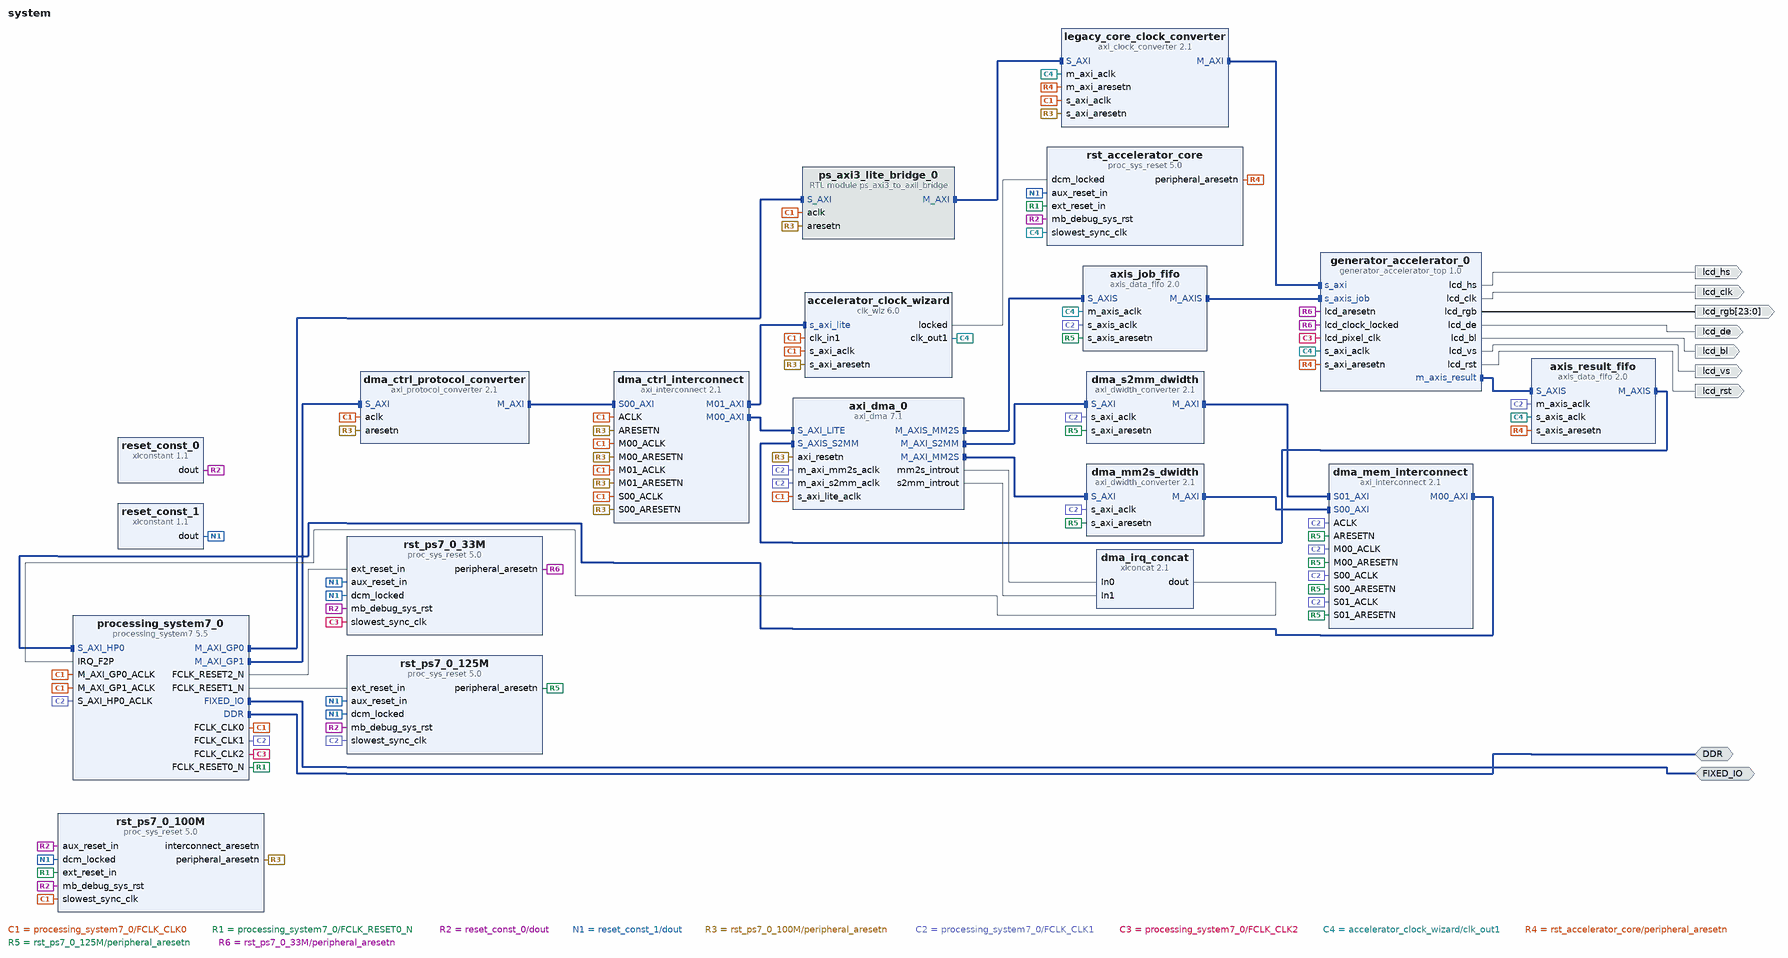
[diagram p0: block diagram of the top level]
# Vivado block design system, xc7z015clg485-2, Vivado 2019.2
create_bd_design system

create_bd_intf_port -mode Master -vlnv xilinx.com:interface:ddrx_rtl:1.0 DDR
create_bd_intf_port -mode Master -vlnv xilinx.com:display_processing_system7:fixedio_rtl:1.0 FIXED_IO
create_bd_port -dir O -from 23 -to 0 lcd_rgb
create_bd_port -dir O lcd_hs
create_bd_port -dir O lcd_vs
create_bd_port -dir O lcd_de
create_bd_port -dir O -type clk lcd_clk
create_bd_port -dir O -type rst lcd_rst
create_bd_port -dir O lcd_bl

create_bd_cell -type ip -vlnv xilinx.com:ip:processing_system7:5.5 processing_system7_0
set_property -dict [list \
  CONFIG.PCW_ENET0_ENET0_IO {MIO 16 .. 27} \
  CONFIG.PCW_ENET0_GRP_MDIO_ENABLE 1 \
  CONFIG.PCW_ENET0_GRP_MDIO_IO {MIO 52 .. 53} \
  CONFIG.PCW_ENET0_PERIPHERAL_ENABLE 1 \
  CONFIG.PCW_EN_CLK1_PORT 1 \
  CONFIG.PCW_EN_CLK2_PORT 1 \
  CONFIG.PCW_EN_RST1_PORT 1 \
  CONFIG.PCW_EN_RST2_PORT 1 \
  CONFIG.PCW_FCLK_CLK1_BUF TRUE \
  CONFIG.PCW_FCLK_CLK2_BUF TRUE \
  CONFIG.PCW_FPGA0_PERIPHERAL_FREQMHZ 100.000000 \
  CONFIG.PCW_FPGA1_PERIPHERAL_FREQMHZ 125.000000 \
  CONFIG.PCW_FPGA2_PERIPHERAL_FREQMHZ 33.000000 \
  CONFIG.PCW_FPGA_FCLK1_ENABLE 1 \
  CONFIG.PCW_FPGA_FCLK2_ENABLE 1 \
  CONFIG.PCW_GPIO_MIO_GPIO_ENABLE 0 \
  CONFIG.PCW_IRQ_F2P_INTR 1 \
  CONFIG.PCW_PRESET_BANK1_VOLTAGE {LVCMOS 1.8V} \
  CONFIG.PCW_UART0_PERIPHERAL_ENABLE 1 \
  CONFIG.PCW_UART0_UART0_IO {MIO 14 .. 15} \
  CONFIG.PCW_UART_PERIPHERAL_FREQMHZ 100 \
  CONFIG.PCW_UIPARAM_DDR_PARTNO {MT41K256M16 RE-125} \
  CONFIG.PCW_USE_FABRIC_INTERRUPT 1 \
  CONFIG.PCW_USE_M_AXI_GP1 1 \
  CONFIG.PCW_USE_S_AXI_HP0 1 \
] [get_bd_cells processing_system7_0]
# 92 more settings of processing_system7_0 are not shown: defaults, MIO pin electricals, DDR timing, and values the tool derives
create_bd_cell -type ip -vlnv xilinx.com:ip:proc_sys_reset:5.0 rst_ps7_0_100M
set_property -dict {CONFIG.C_AUX_RESET_HIGH 1} [get_bd_cells rst_ps7_0_100M]
create_bd_cell -type ip -vlnv xilinx.com:ip:xlconstant:1.1 reset_const_0
set_property -dict {CONFIG.CONST_VAL 0 CONFIG.CONST_WIDTH 1} [get_bd_cells reset_const_0]
create_bd_cell -type ip -vlnv xilinx.com:ip:xlconstant:1.1 reset_const_1
set_property -dict {CONFIG.CONST_VAL 1 CONFIG.CONST_WIDTH 1} [get_bd_cells reset_const_1]
create_bd_cell -type module -reference ps_axi3_to_axil_bridge ps_axi3_lite_bridge_0
create_bd_cell -type ip -vlnv xilinx.com:ip:axi_protocol_converter:2.1 dma_ctrl_protocol_converter
set_property -dict [list \
  CONFIG.ADDR_WIDTH 32 \
  CONFIG.DATA_WIDTH 32 \
  CONFIG.MI_PROTOCOL AXI4LITE \
  CONFIG.SI_PROTOCOL AXI3 \
] [get_bd_cells dma_ctrl_protocol_converter]
create_bd_cell -type ip -vlnv xilinx.com:ip:axi_interconnect:2.1 dma_ctrl_interconnect
set_property -dict {CONFIG.NUM_MI 2 CONFIG.NUM_SI 1} [get_bd_cells dma_ctrl_interconnect]
create_bd_cell -type ip -vlnv xilinx.com:ip:clk_wiz:6.0 accelerator_clock_wizard
set_property -dict [list \
  CONFIG.CLKOUT1_REQUESTED_OUT_FREQ 100.000 \
  CONFIG.INTERFACE_SELECTION Enable_AXI \
  CONFIG.PRIM_IN_FREQ 100.000 \
  CONFIG.USE_DYN_RECONFIG true \
] [get_bd_cells accelerator_clock_wizard]
create_bd_cell -type ip -vlnv xilinx.com:ip:axi_clock_converter:2.1 legacy_core_clock_converter
set_property -dict [list \
  CONFIG.ACLK_ASYNC 1 \
  CONFIG.ADDR_WIDTH 32 \
  CONFIG.DATA_WIDTH 32 \
  CONFIG.PROTOCOL AXI4LITE \
] [get_bd_cells legacy_core_clock_converter]
create_bd_cell -type ip -vlnv xilinx.com:ip:axi_dma:7.1 axi_dma_0
set_property -dict [list \
  CONFIG.c_include_mm2s 1 \
  CONFIG.c_include_mm2s_dre 0 \
  CONFIG.c_include_s2mm 1 \
  CONFIG.c_include_s2mm_dre 0 \
  CONFIG.c_include_sg 0 \
  CONFIG.c_m_axi_mm2s_data_width 128 \
  CONFIG.c_m_axi_s2mm_data_width 128 \
  CONFIG.c_m_axis_mm2s_tdata_width 128 \
  CONFIG.c_mm2s_burst_size 16 \
  CONFIG.c_s2mm_burst_size 16 \
  CONFIG.c_s_axis_s2mm_tdata_width 128 \
  CONFIG.c_sg_length_width 23 \
] [get_bd_cells axi_dma_0]
create_bd_cell -type ip -vlnv xilinx.com:ip:axi_dwidth_converter:2.1 dma_mm2s_dwidth
set_property -dict [list \
  CONFIG.ADDR_WIDTH 32 \
  CONFIG.MI_DATA_WIDTH 64 \
  CONFIG.PROTOCOL AXI4 \
  CONFIG.SI_DATA_WIDTH 128 \
] [get_bd_cells dma_mm2s_dwidth]
create_bd_cell -type ip -vlnv xilinx.com:ip:axi_dwidth_converter:2.1 dma_s2mm_dwidth
set_property -dict [list \
  CONFIG.ADDR_WIDTH 32 \
  CONFIG.MI_DATA_WIDTH 64 \
  CONFIG.PROTOCOL AXI4 \
  CONFIG.SI_DATA_WIDTH 128 \
] [get_bd_cells dma_s2mm_dwidth]
create_bd_cell -type ip -vlnv xilinx.com:ip:axis_data_fifo:2.0 axis_job_fifo
set_property -dict [list \
  CONFIG.FIFO_DEPTH 512 \
  CONFIG.HAS_TKEEP 1 \
  CONFIG.HAS_TLAST 1 \
  CONFIG.IS_ACLK_ASYNC 1 \
  CONFIG.TDATA_NUM_BYTES 16 \
] [get_bd_cells axis_job_fifo]
create_bd_cell -type ip -vlnv xilinx.com:ip:axis_data_fifo:2.0 axis_result_fifo
set_property -dict [list \
  CONFIG.FIFO_DEPTH 512 \
  CONFIG.HAS_TKEEP 1 \
  CONFIG.HAS_TLAST 1 \
  CONFIG.IS_ACLK_ASYNC 1 \
  CONFIG.TDATA_NUM_BYTES 16 \
] [get_bd_cells axis_result_fifo]
create_bd_cell -type ip -vlnv xilinx.com:ip:axi_interconnect:2.1 dma_mem_interconnect
set_property -dict {CONFIG.NUM_MI 1 CONFIG.NUM_SI 2} [get_bd_cells dma_mem_interconnect]
create_bd_cell -type ip -vlnv xilinx.com:ip:proc_sys_reset:5.0 rst_ps7_0_125M
create_bd_cell -type ip -vlnv xilinx.com:ip:proc_sys_reset:5.0 rst_ps7_0_33M
create_bd_cell -type ip -vlnv xilinx.com:ip:proc_sys_reset:5.0 rst_accelerator_core
create_bd_cell -type ip -vlnv xilinx.com:ip:xlconcat:2.1 dma_irq_concat
set_property -dict {CONFIG.NUM_PORTS 2} [get_bd_cells dma_irq_concat]
create_bd_cell -type ip -vlnv xilinx.com:user:generator_accelerator_top:1.0 generator_accelerator_0

# ---- connections ----

connect_bd_intf_net [get_bd_intf_pins axi_dma_0/M_AXIS_MM2S] [get_bd_intf_pins axis_job_fifo/S_AXIS]
connect_bd_intf_net [get_bd_intf_pins axis_result_fifo/M_AXIS] [get_bd_intf_pins axi_dma_0/S_AXIS_S2MM]
connect_bd_intf_net [get_bd_intf_pins axi_dma_0/M_AXI_MM2S] [get_bd_intf_pins dma_mm2s_dwidth/S_AXI]
connect_bd_intf_net [get_bd_intf_pins dma_ctrl_interconnect/M00_AXI] [get_bd_intf_pins axi_dma_0/S_AXI_LITE]
connect_bd_intf_net [get_bd_intf_pins axi_dma_0/M_AXI_S2MM] [get_bd_intf_pins dma_s2mm_dwidth/S_AXI]
connect_bd_intf_net [get_bd_intf_ports FIXED_IO] [get_bd_intf_pins processing_system7_0/FIXED_IO]
connect_bd_intf_net [get_bd_intf_ports DDR] [get_bd_intf_pins processing_system7_0/DDR]
connect_bd_intf_net [get_bd_intf_pins processing_system7_0/M_AXI_GP1] [get_bd_intf_pins dma_ctrl_protocol_converter/S_AXI]
connect_bd_intf_net [get_bd_intf_pins generator_accelerator_0/m_axis_result] [get_bd_intf_pins axis_result_fifo/S_AXIS]
connect_bd_intf_net [get_bd_intf_pins dma_ctrl_interconnect/M01_AXI] [get_bd_intf_pins accelerator_clock_wizard/s_axi_lite]
connect_bd_intf_net [get_bd_intf_pins dma_s2mm_dwidth/M_AXI] [get_bd_intf_pins dma_mem_interconnect/S01_AXI]
connect_bd_intf_net [get_bd_intf_pins processing_system7_0/M_AXI_GP0] [get_bd_intf_pins ps_axi3_lite_bridge_0/S_AXI]
connect_bd_intf_net [get_bd_intf_pins legacy_core_clock_converter/M_AXI] [get_bd_intf_pins generator_accelerator_0/s_axi]
connect_bd_intf_net [get_bd_intf_pins ps_axi3_lite_bridge_0/M_AXI] [get_bd_intf_pins legacy_core_clock_converter/S_AXI]
connect_bd_intf_net -intf_net dma_mem_smartconnect_M00_AXI [get_bd_intf_pins dma_mem_interconnect/M00_AXI] [get_bd_intf_pins processing_system7_0/S_AXI_HP0]
connect_bd_intf_net [get_bd_intf_pins dma_mm2s_dwidth/M_AXI] [get_bd_intf_pins dma_mem_interconnect/S00_AXI]
connect_bd_intf_net [get_bd_intf_pins axis_job_fifo/M_AXIS] [get_bd_intf_pins generator_accelerator_0/s_axis_job]
connect_bd_intf_net [get_bd_intf_pins dma_ctrl_protocol_converter/M_AXI] [get_bd_intf_pins dma_ctrl_interconnect/S00_AXI]
connect_bd_net [get_bd_pins processing_system7_0/FCLK_CLK0] \
  [get_bd_pins processing_system7_0/M_AXI_GP0_ACLK] [get_bd_pins rst_ps7_0_100M/slowest_sync_clk] \
  [get_bd_pins ps_axi3_lite_bridge_0/aclk] [get_bd_pins processing_system7_0/M_AXI_GP1_ACLK] \
  [get_bd_pins dma_ctrl_protocol_converter/aclk] [get_bd_pins dma_ctrl_interconnect/ACLK] \
  [get_bd_pins dma_ctrl_interconnect/S00_ACLK] [get_bd_pins dma_ctrl_interconnect/M00_ACLK] \
  [get_bd_pins dma_ctrl_interconnect/M01_ACLK] [get_bd_pins accelerator_clock_wizard/clk_in1] \
  [get_bd_pins accelerator_clock_wizard/s_axi_aclk] [get_bd_pins legacy_core_clock_converter/s_axi_aclk] \
  [get_bd_pins axi_dma_0/s_axi_lite_aclk]
connect_bd_net [get_bd_pins processing_system7_0/FCLK_RESET0_N] \
  [get_bd_pins rst_ps7_0_100M/ext_reset_in] [get_bd_pins rst_accelerator_core/ext_reset_in]
connect_bd_net [get_bd_pins reset_const_0/dout] \
  [get_bd_pins rst_ps7_0_100M/aux_reset_in] [get_bd_pins rst_ps7_0_100M/mb_debug_sys_rst] \
  [get_bd_pins rst_ps7_0_125M/mb_debug_sys_rst] [get_bd_pins rst_ps7_0_33M/mb_debug_sys_rst] \
  [get_bd_pins rst_accelerator_core/mb_debug_sys_rst]
connect_bd_net [get_bd_pins reset_const_1/dout] \
  [get_bd_pins rst_ps7_0_100M/dcm_locked] [get_bd_pins rst_ps7_0_125M/aux_reset_in] [get_bd_pins rst_ps7_0_125M/dcm_locked] \
  [get_bd_pins rst_ps7_0_33M/aux_reset_in] [get_bd_pins rst_ps7_0_33M/dcm_locked] \
  [get_bd_pins rst_accelerator_core/aux_reset_in]
# net rst_ps7_0_100M_interconnect_aresetn has one end: rst_ps7_0_100M/interconnect_aresetn
connect_bd_net [get_bd_pins rst_ps7_0_100M/peripheral_aresetn] \
  [get_bd_pins ps_axi3_lite_bridge_0/aresetn] [get_bd_pins dma_ctrl_protocol_converter/aresetn] \
  [get_bd_pins dma_ctrl_interconnect/ARESETN] [get_bd_pins dma_ctrl_interconnect/S00_ARESETN] \
  [get_bd_pins dma_ctrl_interconnect/M00_ARESETN] [get_bd_pins dma_ctrl_interconnect/M01_ARESETN] \
  [get_bd_pins accelerator_clock_wizard/s_axi_aresetn] [get_bd_pins legacy_core_clock_converter/s_axi_aresetn] \
  [get_bd_pins axi_dma_0/axi_resetn]
connect_bd_net [get_bd_pins processing_system7_0/FCLK_CLK1] \
  [get_bd_pins processing_system7_0/S_AXI_HP0_ACLK] [get_bd_pins axi_dma_0/m_axi_mm2s_aclk] \
  [get_bd_pins axi_dma_0/m_axi_s2mm_aclk] [get_bd_pins axis_job_fifo/s_axis_aclk] [get_bd_pins axis_result_fifo/m_axis_aclk] \
  [get_bd_pins dma_mm2s_dwidth/s_axi_aclk] [get_bd_pins dma_s2mm_dwidth/s_axi_aclk] [get_bd_pins dma_mem_interconnect/ACLK] \
  [get_bd_pins dma_mem_interconnect/S00_ACLK] [get_bd_pins dma_mem_interconnect/S01_ACLK] \
  [get_bd_pins dma_mem_interconnect/M00_ACLK] [get_bd_pins rst_ps7_0_125M/slowest_sync_clk]
connect_bd_net [get_bd_pins processing_system7_0/FCLK_RESET1_N] [get_bd_pins rst_ps7_0_125M/ext_reset_in]
connect_bd_net [get_bd_pins dma_irq_concat/dout] [get_bd_pins processing_system7_0/IRQ_F2P]
connect_bd_net [get_bd_pins processing_system7_0/FCLK_CLK2] \
  [get_bd_pins rst_ps7_0_33M/slowest_sync_clk] [get_bd_pins generator_accelerator_0/lcd_pixel_clk]
connect_bd_net [get_bd_pins processing_system7_0/FCLK_RESET2_N] [get_bd_pins rst_ps7_0_33M/ext_reset_in]
connect_bd_net [get_bd_pins accelerator_clock_wizard/clk_out1] \
  [get_bd_pins legacy_core_clock_converter/m_axi_aclk] [get_bd_pins axis_job_fifo/m_axis_aclk] \
  [get_bd_pins axis_result_fifo/s_axis_aclk] [get_bd_pins rst_accelerator_core/slowest_sync_clk] \
  [get_bd_pins generator_accelerator_0/s_axi_aclk]
connect_bd_net [get_bd_pins accelerator_clock_wizard/locked] [get_bd_pins rst_accelerator_core/dcm_locked]
connect_bd_net [get_bd_pins rst_accelerator_core/peripheral_aresetn] \
  [get_bd_pins legacy_core_clock_converter/m_axi_aresetn] [get_bd_pins axis_result_fifo/s_axis_aresetn] \
  [get_bd_pins generator_accelerator_0/s_axi_aresetn]
connect_bd_net [get_bd_pins rst_ps7_0_125M/peripheral_aresetn] \
  [get_bd_pins axis_job_fifo/s_axis_aresetn] [get_bd_pins dma_mm2s_dwidth/s_axi_aresetn] \
  [get_bd_pins dma_s2mm_dwidth/s_axi_aresetn] [get_bd_pins dma_mem_interconnect/ARESETN] \
  [get_bd_pins dma_mem_interconnect/S00_ARESETN] [get_bd_pins dma_mem_interconnect/S01_ARESETN] \
  [get_bd_pins dma_mem_interconnect/M00_ARESETN]
connect_bd_net [get_bd_pins rst_ps7_0_33M/peripheral_aresetn] \
  [get_bd_pins generator_accelerator_0/lcd_aresetn] [get_bd_pins generator_accelerator_0/lcd_clock_locked]
connect_bd_net [get_bd_pins generator_accelerator_0/lcd_rgb] [get_bd_ports lcd_rgb]
connect_bd_net [get_bd_pins generator_accelerator_0/lcd_hs] [get_bd_ports lcd_hs]
connect_bd_net [get_bd_pins generator_accelerator_0/lcd_vs] [get_bd_ports lcd_vs]
connect_bd_net [get_bd_pins generator_accelerator_0/lcd_de] [get_bd_ports lcd_de]
connect_bd_net [get_bd_pins generator_accelerator_0/lcd_clk] [get_bd_ports lcd_clk]
connect_bd_net [get_bd_pins generator_accelerator_0/lcd_rst] [get_bd_ports lcd_rst]
connect_bd_net [get_bd_pins generator_accelerator_0/lcd_bl] [get_bd_ports lcd_bl]
connect_bd_net [get_bd_pins axi_dma_0/mm2s_introut] [get_bd_pins dma_irq_concat/In0]
connect_bd_net [get_bd_pins axi_dma_0/s2mm_introut] [get_bd_pins dma_irq_concat/In1]

# ---- address map ----
assign_bd_address -offset 0x00000000 -range 1G -target_address_space [get_bd_addr_spaces axi_dma_0/Data_MM2S] [get_bd_addr_segs processing_system7_0/S_AXI_HP0/HP0_DDR_LOWOCM]
assign_bd_address -offset 0x00000000 -range 1G -target_address_space [get_bd_addr_spaces axi_dma_0/Data_S2MM] [get_bd_addr_segs processing_system7_0/S_AXI_HP0/HP0_DDR_LOWOCM]
assign_bd_address -offset 0x43C00000 -range 256K -target_address_space [get_bd_addr_spaces processing_system7_0/Data] [get_bd_addr_segs ps_axi3_lite_bridge_0/S_AXI/reg0]
assign_bd_address -offset 0x80400000 -range 64K -target_address_space [get_bd_addr_spaces processing_system7_0/Data] [get_bd_addr_segs axi_dma_0/S_AXI_LITE/Reg]
assign_bd_address -offset 0x80410000 -range 64K -target_address_space [get_bd_addr_spaces processing_system7_0/Data] [get_bd_addr_segs accelerator_clock_wizard/s_axi_lite/Reg]
assign_bd_address -offset 0x43C00000 -range 256K -target_address_space [get_bd_addr_spaces ps_axi3_lite_bridge_0/M_AXI] [get_bd_addr_segs generator_accelerator_0/s_axi/reg0]

validate_bd_design
save_bd_design
